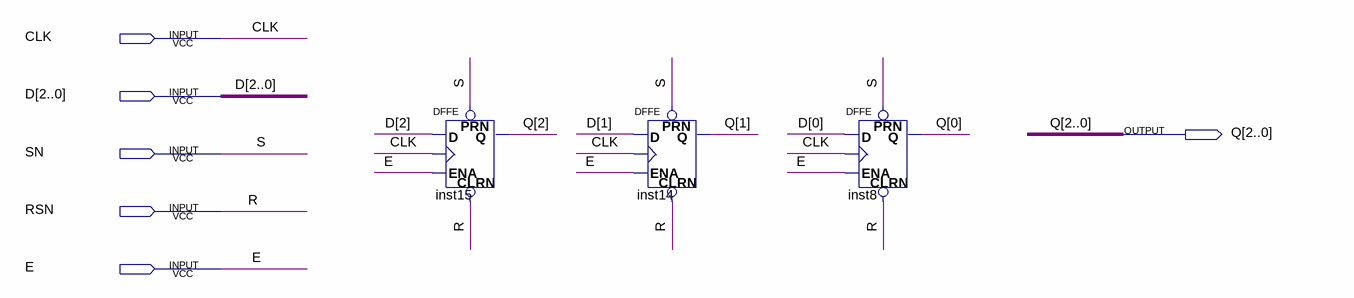
[diagram p0: schematic sheet]
// Quartus schematic REGISTER_3bit.bdf as structural Verilog: 3 symbols, 6 pins
module REGISTER_3bit (
  input  CLK,
  input  [2:0] D,
  input  SN,
  input  RSN,
  input  E,
  output [2:0] Q
);

  DFFE inst15 (.PRN(SN), .CLRN(RSN), .D(D[2]), .CLK(CLK), .ENA(E), .Q(Q[2]));
  DFFE inst14 (.PRN(SN), .CLRN(RSN), .D(D[1]), .CLK(CLK), .ENA(E), .Q(Q[1]));
  DFFE inst8 (.PRN(SN), .CLRN(RSN), .D(D[0]), .CLK(CLK), .ENA(E), .Q(Q[0]));

  // Other names for the same wires on the sheet: R = RSN; S = SN
endmodule
